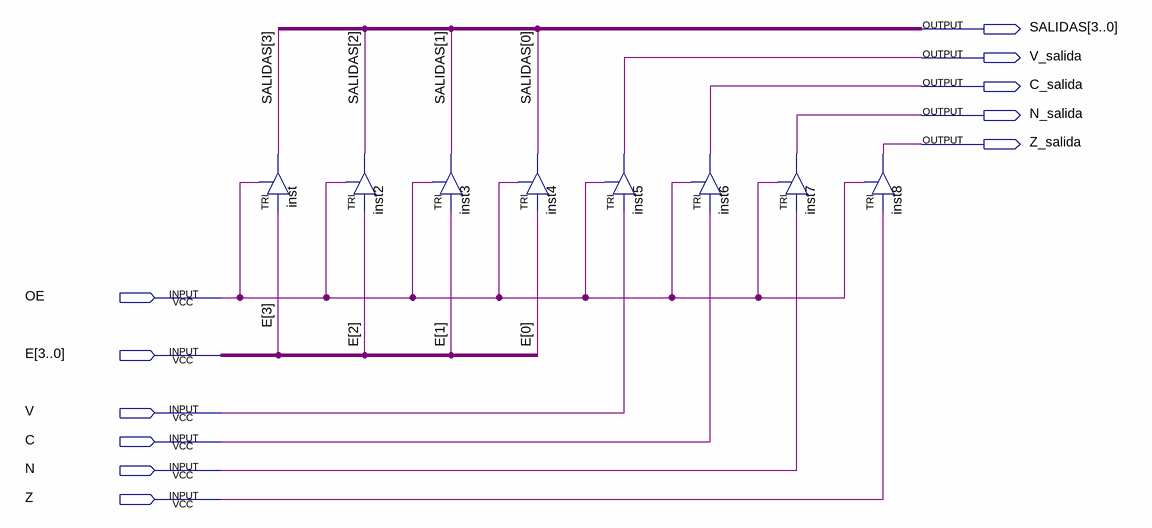
[diagram p0: schematic sheet]
// Quartus schematic OutputEnable.bdf as structural Verilog: 8 symbols, 11 pins
module OutputEnable (
  input  OE,
  input  [3:0] E,
  input  V,
  input  C,
  input  N,
  input  Z,
  output [3:0] SALIDAS,
  output V_salida,
  output C_salida,
  output N_salida,
  output Z_salida
);

  TRI inst (.IN(E[3]), .OE(OE), .OUT(SALIDAS[3]));
  TRI inst2 (.IN(E[2]), .OE(OE), .OUT(SALIDAS[2]));
  TRI inst3 (.IN(E[1]), .OE(OE), .OUT(SALIDAS[1]));
  TRI inst4 (.IN(E[0]), .OE(OE), .OUT(SALIDAS[0]));
  TRI inst5 (.IN(V), .OE(OE), .OUT(V_salida));
  TRI inst6 (.IN(C), .OE(OE), .OUT(C_salida));
  TRI inst7 (.IN(N), .OE(OE), .OUT(N_salida));
  TRI inst8 (.IN(Z), .OE(OE), .OUT(Z_salida));
endmodule
